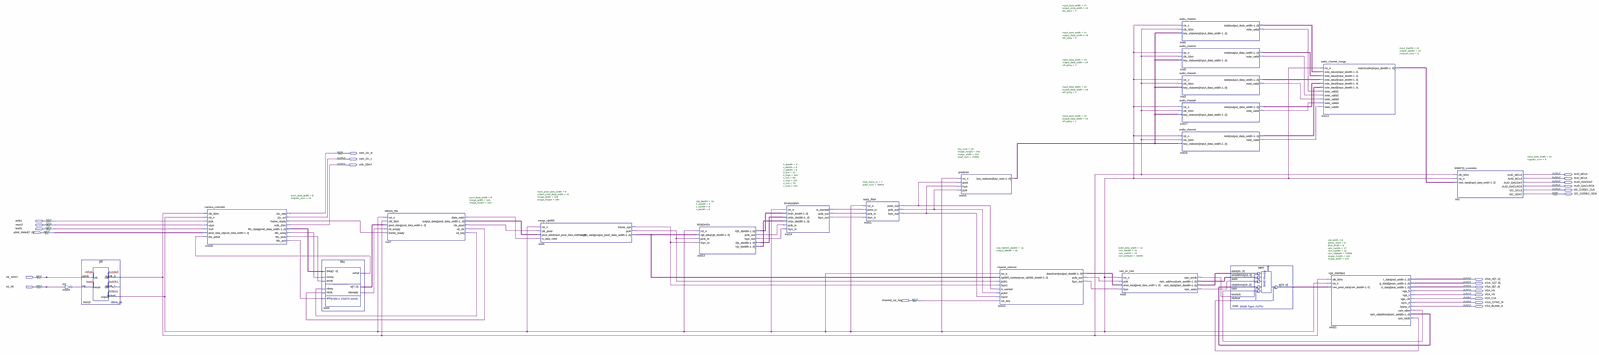
[diagram p0: schematic sheet, whole]
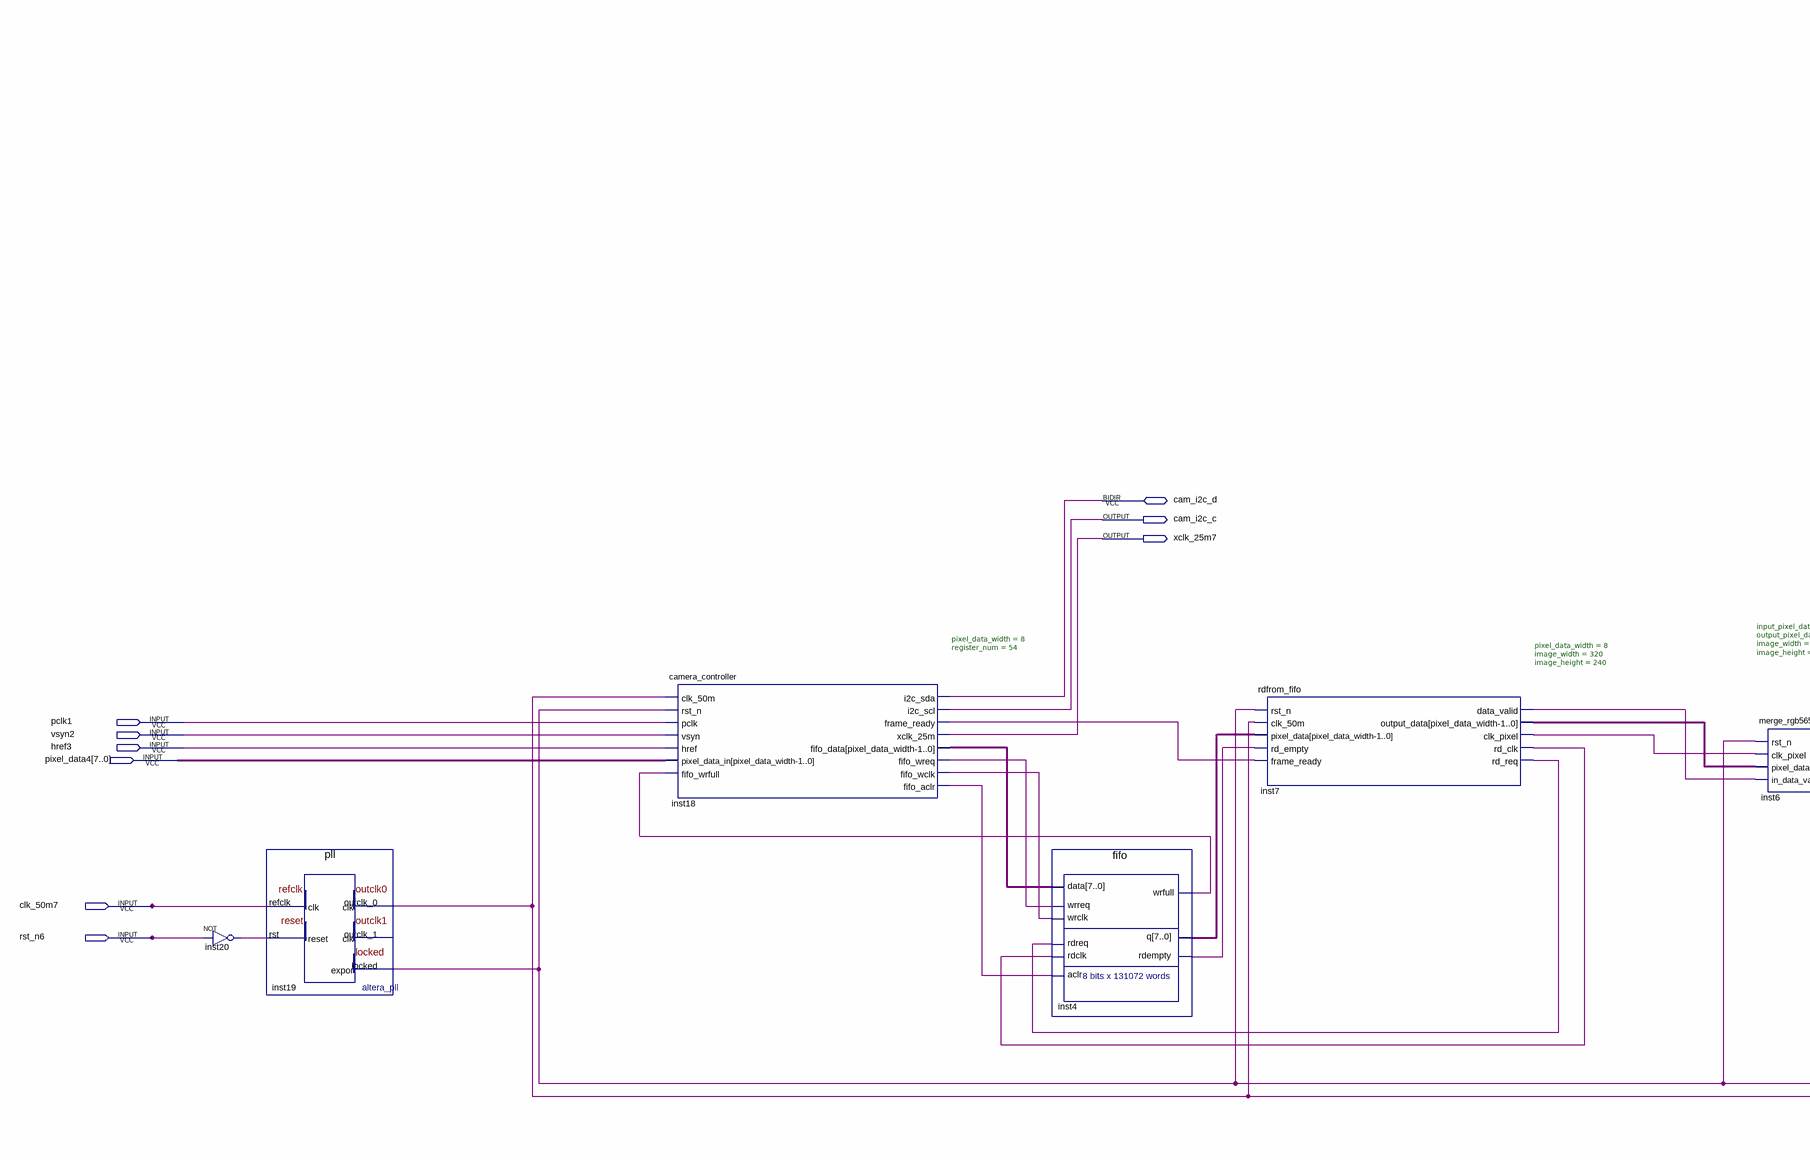
[diagram p1: schematic sheet, left part]
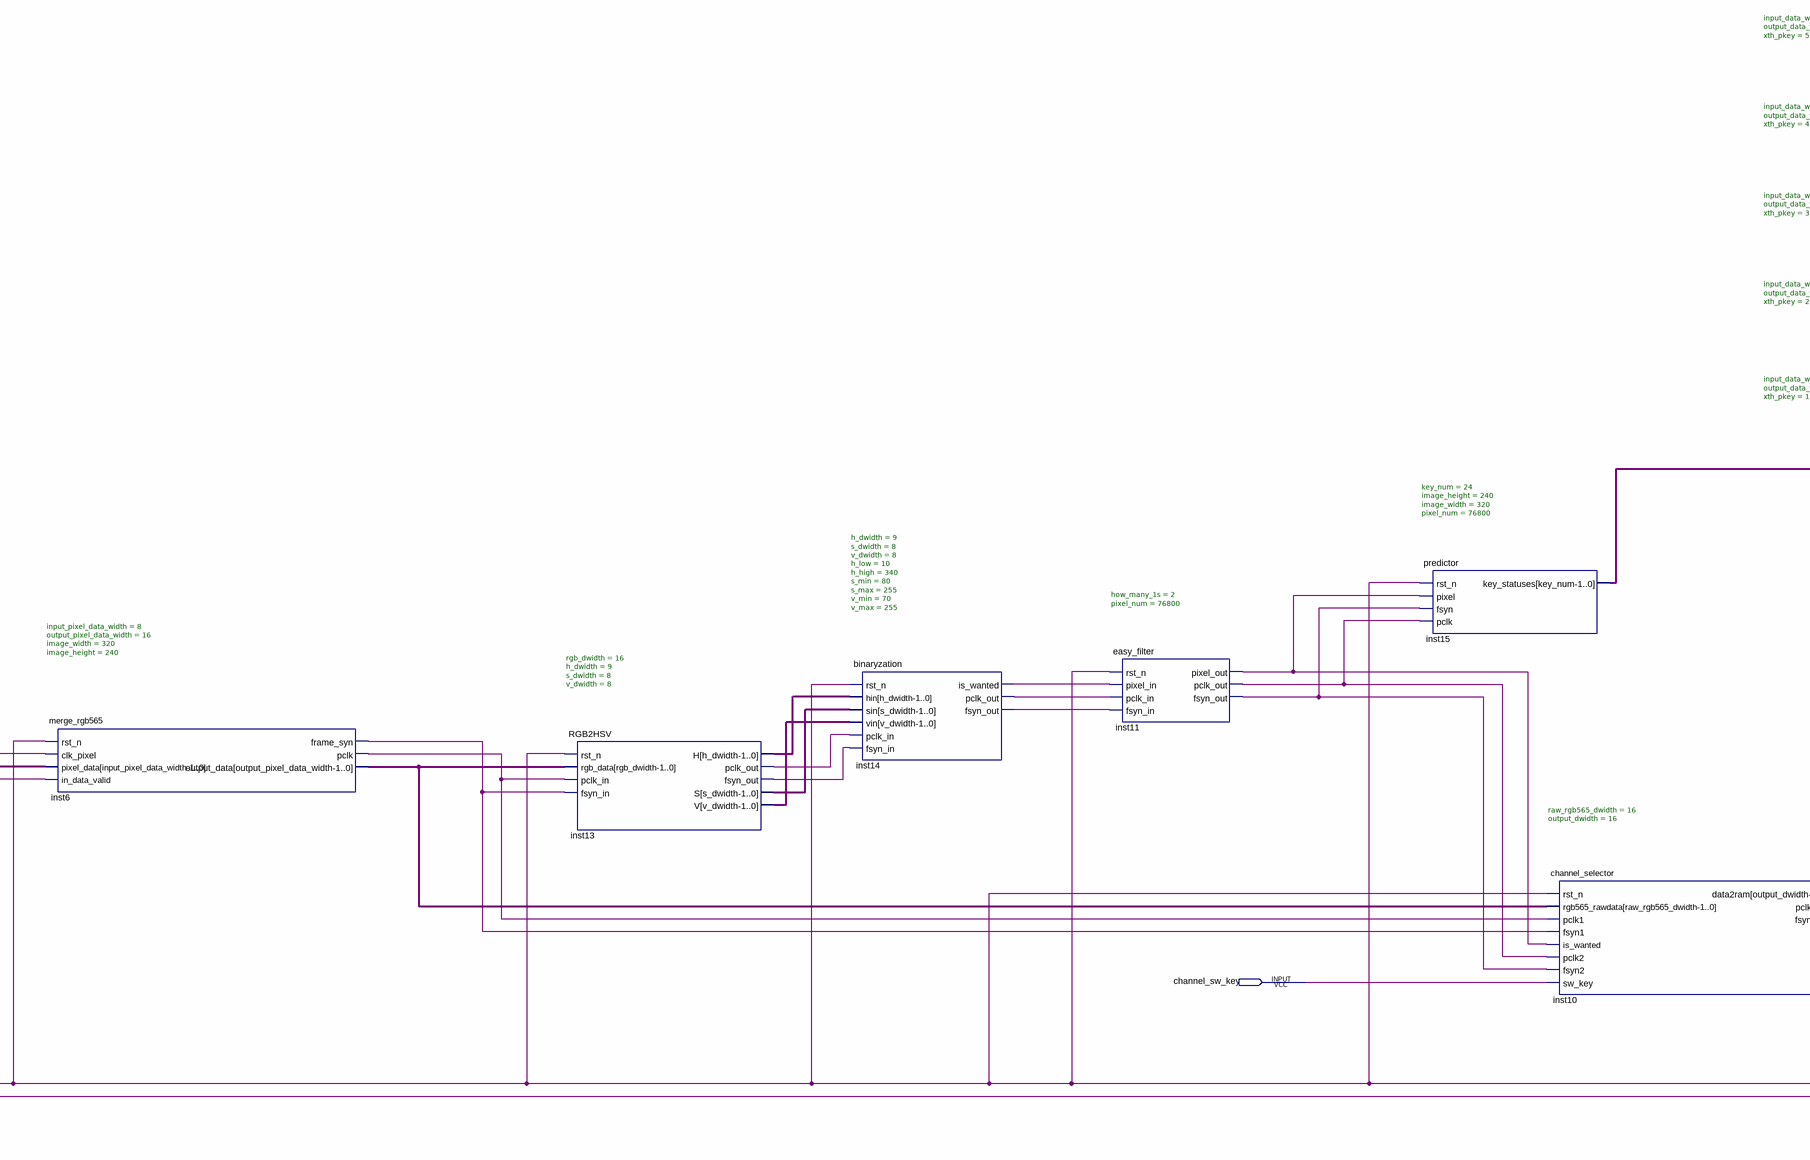
[diagram p2: schematic sheet, centre part]
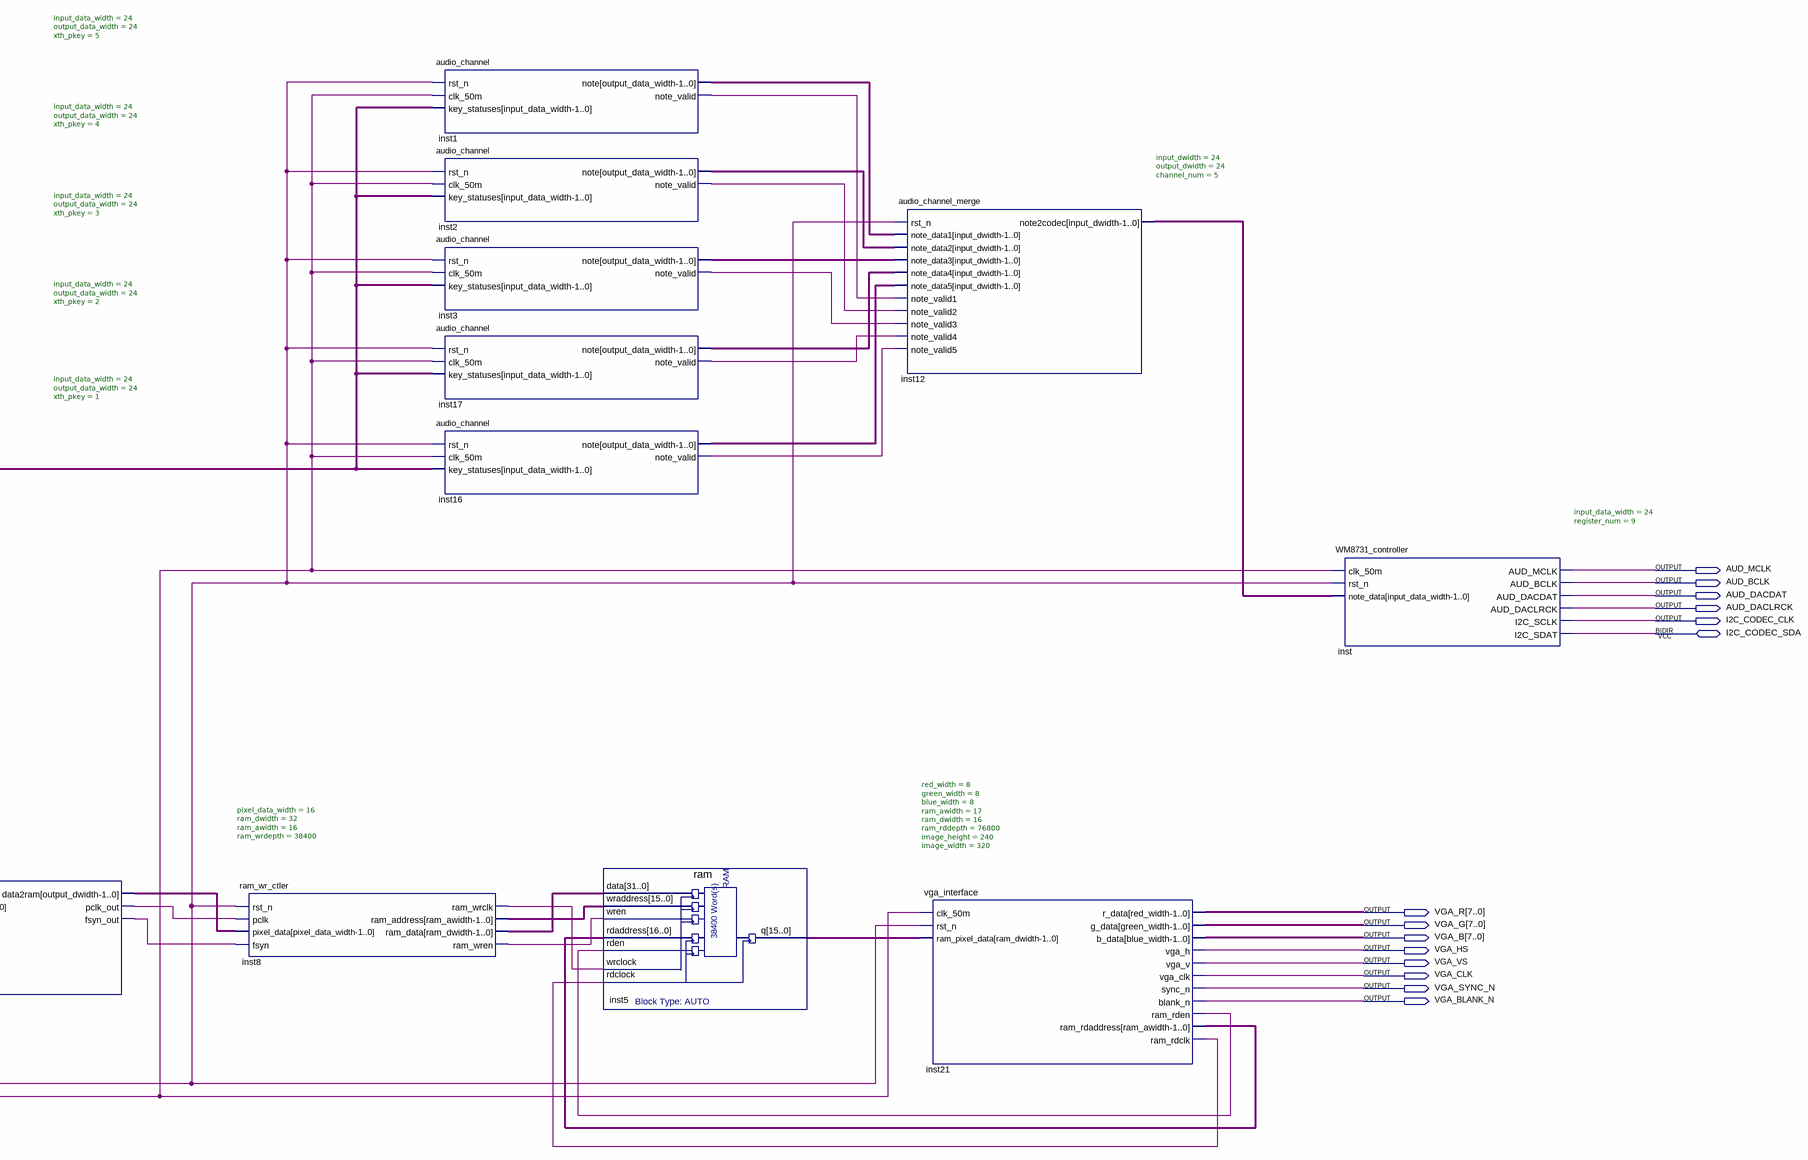
[diagram p3: schematic sheet, right part]
// Quartus schematic VirtualPiano.bdf as structural Verilog: 21 symbols, 24 pins
module VirtualPiano (
  input  pclk1,
  input  vsyn2,
  input  href3,
  input  [7:0] pixel_data4,
  input  clk_50m7,
  input  rst_n6,
  input  channel_sw_key,
  inout  cam_i2c_d,
  inout  I2C_CODEC_SDA,
  output cam_i2c_c,
  output xclk_25m7,
  output AUD_MCLK,
  output AUD_BCLK,
  output AUD_DACDAT,
  output AUD_DACLRCK,
  output I2C_CODEC_CLK,
  output [7:0] VGA_R,
  output [7:0] VGA_G,
  output [7:0] VGA_B,
  output VGA_HS,
  output VGA_VS,
  output VGA_CLK,
  output VGA_SYNC_N,
  output VGA_BLANK_N
);

  wire inst1_note_valid, inst2_note_valid, inst3_note_valid, inst4_rdempty, inst4_wrfull, inst6_frame_syn,
       inst6_pclk, inst7_clk_pixel, inst7_data_valid, inst7_rd_clk, inst7_rd_req, inst8_ram_wrclk,
       inst8_ram_wren, inst10_fsyn_out, inst10_pclk_out, inst11_fsyn_out, inst11_pclk_out, inst11_pixel_out,
       inst13_fsyn_out, inst13_pclk_out, inst14_fsyn_out, inst14_is_wanted, inst14_pclk_out,
       inst16_note_valid, inst17_note_valid, inst18_fifo_aclr, inst18_fifo_wclk, inst18_fifo_wreq,
       inst18_frame_ready, inst19_locked, inst19_outclk_0, inst20_out, inst21_ram_rdclk, inst21_ram_rden;
  wire [7:0] inst4_q, inst7_output_data, inst13_s, inst13_v, inst18_fifo_data;
  wire [8:0] inst13_h;
  wire [15:0] inst5_q, inst6_output_data, inst8_ram_address, inst10_data2ram;
  wire [16:0] inst21_ram_rdaddress;
  wire [23:0] inst1_note, inst2_note, inst3_note, inst12_note2codec, inst15_key_statuses, inst16_note,
       inst17_note;
  wire [31:0] inst8_ram_data;

  not inst20 (inst20_out, rst_n6);
  pll inst19 (
    .refclk(clk_50m7), .rst(inst20_out), .outclk_0(inst19_outclk_0), .locked(inst19_locked));  // open: outclk_1
  camera_controller #(.pixel_data_width(8), .register_num(54)) inst18 (
    .clk_50m(inst19_outclk_0), .rst_n(inst19_locked), .pclk(pclk1), .vsyn(vsyn2), .href(href3),
    .pixel_data_in(pixel_data4), .fifo_wrfull(inst4_wrfull), .i2c_scl(cam_i2c_c),
    .frame_ready(inst18_frame_ready), .xclk_25m(xclk_25m7), .fifo_data(inst18_fifo_data),
    .fifo_wreq(inst18_fifo_wreq), .fifo_wclk(inst18_fifo_wclk), .fifo_aclr(inst18_fifo_aclr),
    .i2c_sda(cam_i2c_d));
  fifo inst4 (
    .data(inst18_fifo_data), .wrreq(inst18_fifo_wreq), .wrclk(inst18_fifo_wclk), .rdreq(inst7_rd_req),
    .rdclk(inst7_rd_clk), .aclr(inst18_fifo_aclr), .wrfull(inst4_wrfull), .q(inst4_q), .rdempty(inst4_rdempty));
  rdfrom_fifo #(.pixel_data_width(8), .image_width(320), .image_height(240)) inst7 (
    .rst_n(inst19_locked), .clk_50m(inst19_outclk_0), .pixel_data(inst4_q), .rd_empty(inst4_rdempty),
    .frame_ready(inst18_frame_ready), .data_valid(inst7_data_valid), .output_data(inst7_output_data),
    .clk_pixel(inst7_clk_pixel), .rd_clk(inst7_rd_clk), .rd_req(inst7_rd_req));
  merge_rgb565 #(.input_pixel_data_width(8), .output_pixel_data_width(16), .image_width(320), .image_height(240)) inst6 (
    .rst_n(inst19_locked), .clk_pixel(inst7_clk_pixel), .pixel_data(inst7_output_data),
    .in_data_valid(inst7_data_valid), .frame_syn(inst6_frame_syn), .pclk(inst6_pclk),
    .output_data(inst6_output_data));
  RGB2HSV #(.rgb_dwidth(16), .h_dwidth(9), .s_dwidth(8), .v_dwidth(8)) inst13 (
    .rst_n(inst19_locked), .rgb_data(inst6_output_data), .pclk_in(inst6_pclk), .fsyn_in(inst6_frame_syn),
    .H(inst13_h), .pclk_out(inst13_pclk_out), .fsyn_out(inst13_fsyn_out), .S(inst13_s), .V(inst13_v));
  binaryzation #(.h_dwidth(9), .s_dwidth(8), .v_dwidth(8), .h_low(10), .h_high(340), .s_min(80), .s_max(255), .v_min(70), .v_max(255)) inst14 (
    .rst_n(inst19_locked), .hin(inst13_h), .sin(inst13_s), .vin(inst13_v), .pclk_in(inst13_pclk_out),
    .fsyn_in(inst13_fsyn_out), .is_wanted(inst14_is_wanted), .pclk_out(inst14_pclk_out),
    .fsyn_out(inst14_fsyn_out));
  easy_filter #(.how_many_1s(2), .pixel_num(76800)) inst11 (
    .rst_n(inst19_locked), .pixel_in(inst14_is_wanted), .pclk_in(inst14_pclk_out), .fsyn_in(inst14_fsyn_out),
    .pixel_out(inst11_pixel_out), .pclk_out(inst11_pclk_out), .fsyn_out(inst11_fsyn_out));
  predictor #(.key_num(24), .image_height(240), .image_width(320), .pixel_num(76800)) inst15 (
    .rst_n(inst19_locked), .pixel(inst11_pixel_out), .fsyn(inst11_fsyn_out), .pclk(inst11_pclk_out),
    .key_statuses(inst15_key_statuses));
  channel_selector #(.raw_rgb565_dwidth(16), .output_dwidth(16)) inst10 (
    .rst_n(inst19_locked), .rgb565_rawdata(inst6_output_data), .pclk1(inst6_pclk), .fsyn1(inst6_frame_syn),
    .is_wanted(inst11_pixel_out), .pclk2(inst11_pclk_out), .fsyn2(inst11_fsyn_out), .sw_key(channel_sw_key),
    .data2ram(inst10_data2ram), .pclk_out(inst10_pclk_out), .fsyn_out(inst10_fsyn_out));
  ram_wr_ctler #(.pixel_data_width(16), .ram_dwidth(32), .ram_awidth(16), .ram_wrdepth(38400)) inst8 (
    .rst_n(inst19_locked), .pclk(inst10_pclk_out), .pixel_data(inst10_data2ram), .fsyn(inst10_fsyn_out),
    .ram_wrclk(inst8_ram_wrclk), .ram_address(inst8_ram_address), .ram_data(inst8_ram_data),
    .ram_wren(inst8_ram_wren));
  audio_channel #(.input_data_width(24), .output_data_width(24), .xth_pkey(5)) inst1 (
    .rst_n(inst19_locked), .clk_50m(inst19_outclk_0), .key_statuses(inst15_key_statuses), .note(inst1_note),
    .note_valid(inst1_note_valid));
  audio_channel #(.input_data_width(24), .output_data_width(24), .xth_pkey(4)) inst2 (
    .rst_n(inst19_locked), .clk_50m(inst19_outclk_0), .key_statuses(inst15_key_statuses), .note(inst2_note),
    .note_valid(inst2_note_valid));
  audio_channel #(.input_data_width(24), .output_data_width(24), .xth_pkey(3)) inst3 (
    .rst_n(inst19_locked), .clk_50m(inst19_outclk_0), .key_statuses(inst15_key_statuses), .note(inst3_note),
    .note_valid(inst3_note_valid));
  audio_channel #(.input_data_width(24), .output_data_width(24), .xth_pkey(2)) inst17 (
    .rst_n(inst19_locked), .clk_50m(inst19_outclk_0), .key_statuses(inst15_key_statuses), .note(inst17_note),
    .note_valid(inst17_note_valid));
  audio_channel #(.input_data_width(24), .output_data_width(24), .xth_pkey(1)) inst16 (
    .rst_n(inst19_locked), .clk_50m(inst19_outclk_0), .key_statuses(inst15_key_statuses), .note(inst16_note),
    .note_valid(inst16_note_valid));
  ram inst5 (
    .data(inst8_ram_data), .wraddress(inst8_ram_address), .wren(inst8_ram_wren),
    .rdaddress(inst21_ram_rdaddress), .rden(inst21_ram_rden), .wrclock(inst8_ram_wrclk),
    .rdclock(inst21_ram_rdclk), .q(inst5_q));
  audio_channel_merge #(.input_dwidth(24), .output_dwidth(24), .channel_num(5)) inst12 (
    .rst_n(inst19_locked), .note_data1(inst1_note), .note_data2(inst2_note), .note_data3(inst3_note),
    .note_data4(inst17_note), .note_data5(inst16_note), .note_valid1(inst1_note_valid),
    .note_valid2(inst2_note_valid), .note_valid3(inst3_note_valid), .note_valid4(inst17_note_valid),
    .note_valid5(inst16_note_valid), .note2codec(inst12_note2codec));
  vga_interface #(.red_width(8), .green_width(8), .blue_width(8), .ram_awidth(17), .ram_dwidth(16), .ram_rddepth(76800), .image_height(240), .image_width(320)) inst21 (
    .clk_50m(inst19_outclk_0), .rst_n(inst19_locked), .ram_pixel_data(inst5_q), .r_data(VGA_R),
    .g_data(VGA_G), .b_data(VGA_B), .vga_h(VGA_HS), .vga_v(VGA_VS), .vga_clk(VGA_CLK), .sync_n(VGA_SYNC_N),
    .blank_n(VGA_BLANK_N), .ram_rden(inst21_ram_rden), .ram_rdaddress(inst21_ram_rdaddress),
    .ram_rdclk(inst21_ram_rdclk));
  WM8731_controller #(.input_data_width(24), .register_num(9)) inst (
    .clk_50m(inst19_outclk_0), .rst_n(inst19_locked), .note_data(inst12_note2codec), .AUD_MCLK(AUD_MCLK),
    .AUD_BCLK(AUD_BCLK), .AUD_DACDAT(AUD_DACDAT), .AUD_DACLRCK(AUD_DACLRCK), .I2C_SCLK(I2C_CODEC_CLK),
    .I2C_SDAT(I2C_CODEC_SDA));
endmodule
